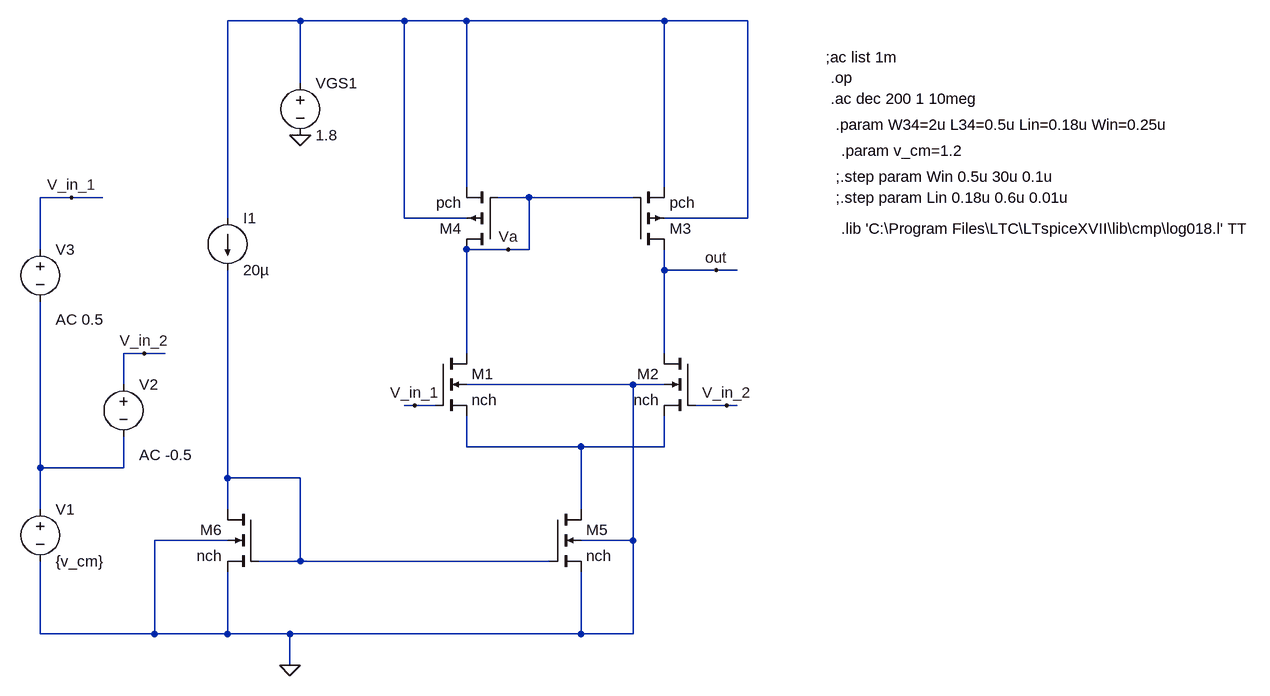
[diagram p0: schematic Draft4.asc]
Draft4.asc, the LTspice schematic file:
Version 4
SHEET 1 1480 680
WIRE -64 -368 -176 -368
WIRE 96 -368 -64 -368
WIRE 192 -368 96 -368
WIRE 496 -368 192 -368
WIRE 624 -368 496 -368
WIRE -64 -272 -64 -368
WIRE 192 -112 192 -368
WIRE 496 -112 496 -368
WIRE -416 -96 -464 -96
WIRE -368 -96 -416 -96
WIRE 288 -96 240 -96
WIRE 448 -96 288 -96
WIRE -176 -64 -176 -368
WIRE 96 -64 96 -368
WIRE 192 -64 96 -64
WIRE 624 -64 624 -368
WIRE 624 -64 496 -64
WIRE -464 -16 -464 -96
WIRE 256 -16 192 -16
WIRE 288 -16 288 -96
WIRE 288 -16 256 -16
WIRE 496 16 496 -16
WIRE 576 16 496 16
WIRE 608 16 576 16
WIRE -304 144 -336 144
WIRE -272 144 -304 144
WIRE 192 144 192 -16
WIRE 496 144 496 16
WIRE -336 192 -336 144
WIRE 448 192 192 192
WIRE 496 192 448 192
WIRE 112 224 96 224
WIRE 144 224 112 224
WIRE 592 224 544 224
WIRE 608 224 592 224
WIRE 192 288 192 240
WIRE 368 288 192 288
WIRE 496 288 496 240
WIRE 496 288 368 288
WIRE -464 320 -464 64
WIRE -336 320 -336 272
WIRE -336 320 -464 320
WIRE -176 336 -176 16
WIRE -64 336 -176 336
WIRE -464 384 -464 320
WIRE -176 384 -176 336
WIRE 368 384 368 288
WIRE -176 432 -288 432
WIRE 448 432 448 192
WIRE 448 432 368 432
WIRE -64 464 -64 336
WIRE -64 464 -128 464
WIRE 320 464 -64 464
WIRE -464 576 -464 464
WIRE -288 576 -288 432
WIRE -288 576 -464 576
WIRE -176 576 -176 480
WIRE -176 576 -288 576
WIRE -80 576 -176 576
WIRE 368 576 368 480
WIRE 368 576 -80 576
WIRE 448 576 448 432
WIRE 448 576 368 576
WIRE -80 624 -80 576
FLAG -64 -192 0
FLAG -80 624 0
FLAG 576 16 out
FLAG 592 224 V_in_2
FLAG 112 224 V_in_1
FLAG 256 -16 Va
FLAG -304 144 V_in_2
FLAG -416 -96 V_in_1
DATAFLAG 496 64 ""
DATAFLAG 192 64 ""
DATAFLAG 368 -96 ""
DATAFLAG 336 288 ""
DATAFLAG -128 336 ""
DATAFLAG -176 48 ""
SYMBOL nmos4 144 144 R0
SYMATTR InstName M1
SYMATTR Value nch
SYMATTR Value2 l={Lin} w={Win}
SYMBOL nmos4 544 144 M0
SYMATTR InstName M2
SYMATTR Value nch
SYMATTR Value2 l=0.18u w=0.25u
SYMBOL pmos4 448 -16 M180
SYMATTR InstName M3
SYMATTR Value pch
SYMATTR Value2 l={L34} w={W34}
SYMBOL pmos4 240 -16 R180
SYMATTR InstName M4
SYMATTR Value pch
SYMATTR Value2 l={L34} w={W34}
SYMBOL nmos4 320 384 R0
SYMATTR InstName M5
SYMATTR Value nch
SYMATTR Value2 l=5u w=30u
SYMBOL nmos4 -128 384 M0
SYMATTR InstName M6
SYMATTR Value nch
SYMATTR Value2 l=5u w=15u
SYMBOL voltage -464 368 R0
WINDOW 123 0 0 Left 0
WINDOW 39 0 0 Left 0
SYMATTR InstName V1
SYMATTR Value {v_cm}
SYMBOL voltage -336 176 R0
WINDOW 123 24 124 Left 2
WINDOW 39 0 0 Left 0
SYMATTR InstName V2
SYMATTR Value ""
SYMATTR Value2 AC -0.5
SYMBOL voltage -464 -32 R0
WINDOW 123 24 124 Left 2
WINDOW 39 0 0 Left 0
SYMATTR InstName V3
SYMATTR Value ""
SYMATTR Value2 AC 0.5
SYMBOL voltage -64 -288 R0
WINDOW 123 0 0 Left 0
WINDOW 39 0 0 Left 0
SYMATTR InstName VGS1
SYMATTR Value 1.8
SYMBOL current -176 -64 R0
WINDOW 123 0 0 Left 0
WINDOW 39 0 0 Left 0
SYMATTR InstName I1
SYMATTR Value 20µ
TEXT 744 -312 Left 2 !;ac list 1m
TEXT 752 -280 Left 2 !.op
TEXT 752 -248 Left 2 !.ac dec 200 1 10meg
TEXT 760 -208 Left 2 !.param W34=2u L34=0.5u Lin=0.18u Win=0.25u
TEXT 768 -168 Left 2 !.param v_cm=1.2
TEXT 760 -128 Left 2 !;.step param Win 0.5u 30u 0.1u
TEXT 760 -96 Left 2 !;.step param Lin 0.18u 0.6u 0.01u
TEXT 768 -48 Left 2 !.lib 'C:\\Program Files\\LTC\\LTspiceXVII\\lib\\cmp\\log018.l' TT

The netlist it stands for:
* Draft4.asc
M1 Va V_in_1 N002 0 nch l={Lin} w={Win}
M2 out V_in_2 N002 0 nch l=0.18u w=0.25u
M3 out Va N001 N001 pch l={L34} w={W34}
M4 Va Va N001 N001 pch l={L34} w={W34}
M5 N002 N004 0 0 nch l=5u w=30u
M6 N004 N004 0 0 nch l=5u w=15u
V1 N003 0 {v_cm}
V2 V_in_2 N003 AC -0.5
V3 V_in_1 N003 AC 0.5
VGS1 N001 0 1.8
I1 N001 N004 20µ
.model NMOS NMOS
.model PMOS PMOS
.lib standard.mos
;ac list 1m
.op
.ac dec 200 1 10meg
.param W34=2u L34=0.5u Lin=0.18u Win=0.25u
.param v_cm=1.2
;.step param Win 0.5u 30u 0.1u
;.step param Lin 0.18u 0.6u 0.01u
.lib 'C:\Program Files\LTC\LTspiceXVII\lib\cmp\log018.l' TT
.backanno
.end